# EAGLE design controller (EAGLE 9.5.2)

## Sheet 1 of 4: Controller
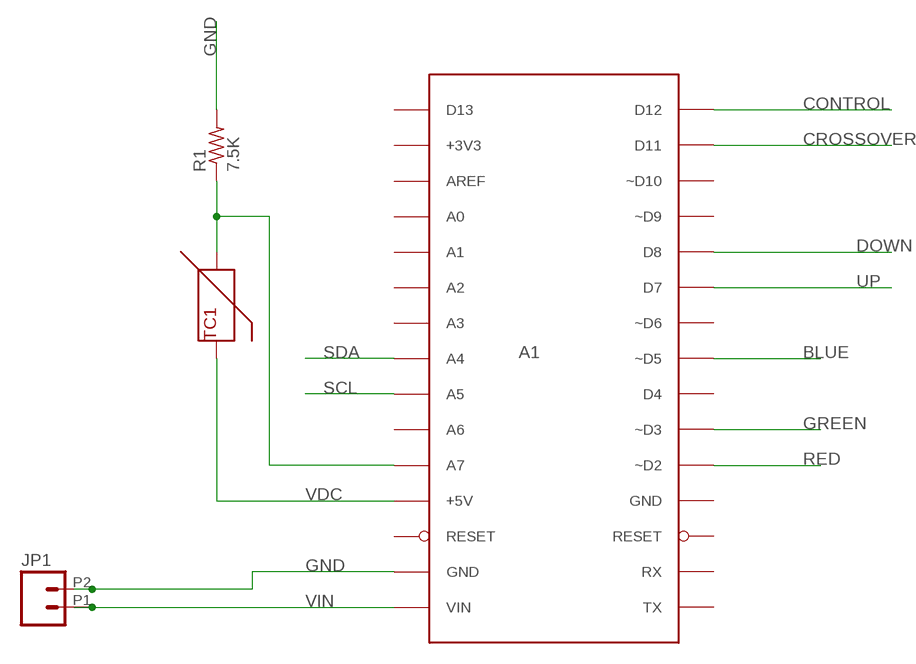
[diagram p0: schematic, sheet 1]

### Parts
A1  NANO_EVERY  [NANO_EVERY_SOCKET]
JP1  1716060000  [WM2-2]
R1  7.5K  YAGEO_CFR  [CFR-25]
TC1  MA100GG103AN  [MA100GG103AN]

### Nets
BLUE: A1.~D5 ; also sheet 3
CONTROL: A1.D12 ; also sheet 2
CROSSOVER: A1.D11 ; also sheet 2
DOWN: A1.D8 ; also sheet 4
GND: A1.GND@1(GND) JP1.P2 R1.P$2 ; also sheet 2,3
GREEN: A1.~D3 ; also sheet 3
N$1: A1.A7 R1.P$1 TC1.P$2
RED: A1.~D2 ; also sheet 3
SCL: A1.A5 ; also sheet 3
SDA: A1.A4 ; also sheet 3
UP: A1.D7 ; also sheet 4
VDC: A1.+5V TC1.P$1 ; also sheet 3,4
VIN: A1.VIN JP1.P1
Unconnected: A1.+3V3 A1.A0 A1.A1 A1.A2 A1.A3 A1.A6 A1.AREF A1.D4 A1.D13 A1.GND@2(GND) A1.RESET@1(RESET) A1.RESET@2(RESET) A1.RX A1.TX A1.~D6 A1.~D9 A1.~D10

## Sheet 2 of 4: Control output
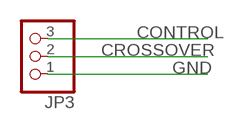
[diagram p1: schematic, sheet 2]

### Parts
JP3  PINHD-1X3/90  [1X03/90]

### Nets
CONTROL: JP3.3 ; also sheet 1
CROSSOVER: JP3.2 ; also sheet 1
GND: JP3.1 ; also sheet 1,3

## Sheet 3 of 4: LCD
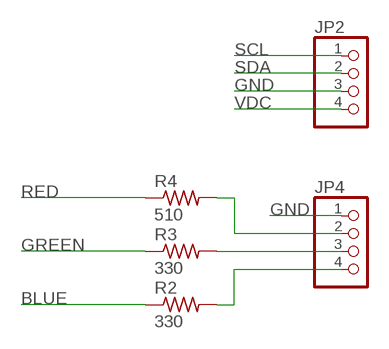
[diagram p2: schematic, sheet 3]

### Parts
JP2  PINHD-1X4  [1X04]
JP4  PINHD-1X4  [1X04]
R2  330  YAGEO-CFR-25  [CFR-25]
R3  330  YAGEO-CFR-25  [CFR-25]
R4  510  YAGEO-CFR-25  [CFR-25]

### Nets
BLUE: R2.P$1 ; also sheet 1
GND: JP2.3 JP4.1 ; also sheet 1,2
GREEN: R3.P$1 ; also sheet 1
N$2: JP4.4 R2.P$2
N$3: JP4.3 R3.P$2
N$4: JP4.2 R4.P$2
RED: R4.P$1 ; also sheet 1
SCL: JP2.1 ; also sheet 1
SDA: JP2.2 ; also sheet 1
VDC: JP2.4 ; also sheet 1,4

## Sheet 4 of 4: User Interface
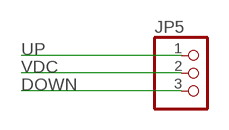
[diagram p3: schematic, sheet 4]

### Parts
JP5  PINHD-1X3  [1X03]

### Nets
DOWN: JP5.3 ; also sheet 1
UP: JP5.1 ; also sheet 1
VDC: JP5.2 ; also sheet 1,3

## Library data of the parts
A1 = Arduino:NANO_EVERY: Nano Every daughter board.
JP1 = ref_lib:1716060000
JP2 JP4 = pinhead:PINHD-1X4: PIN HEADER
JP3 JP5 = pinhead:PINHD-1X3: PIN HEADER
R1 = ref_lib:YAGEO_CFR
R2-R4 = ref_lib:YAGEO-CFR-25
TC1 = thermo:MA100GG103AN: Amphenol thermister

## Board
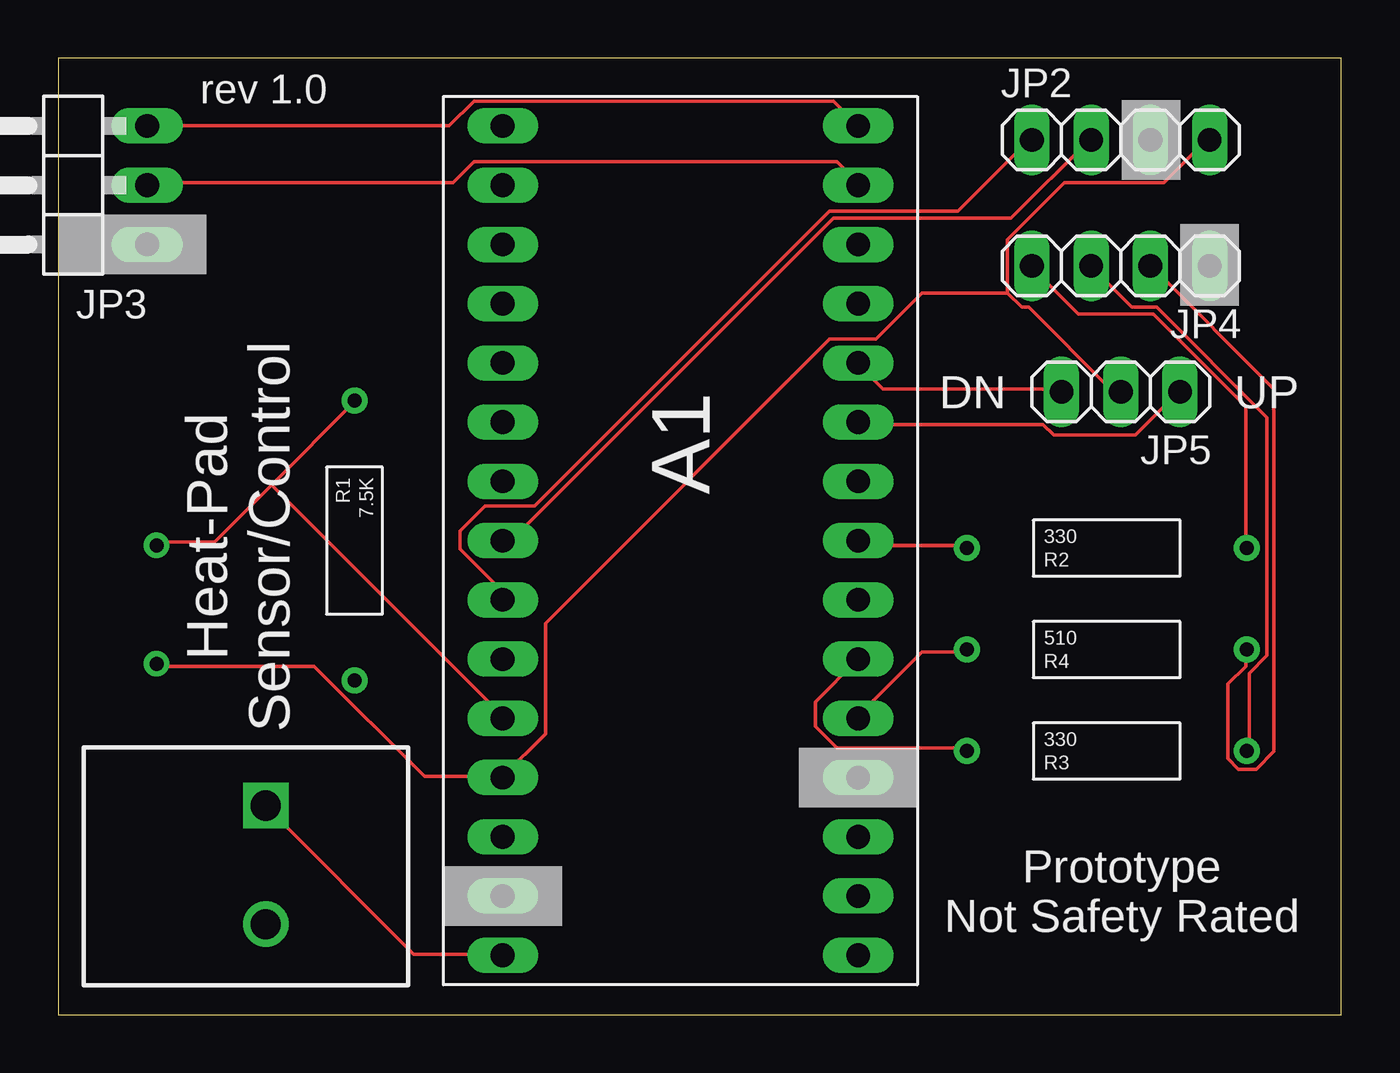
[diagram p4: board, top side]
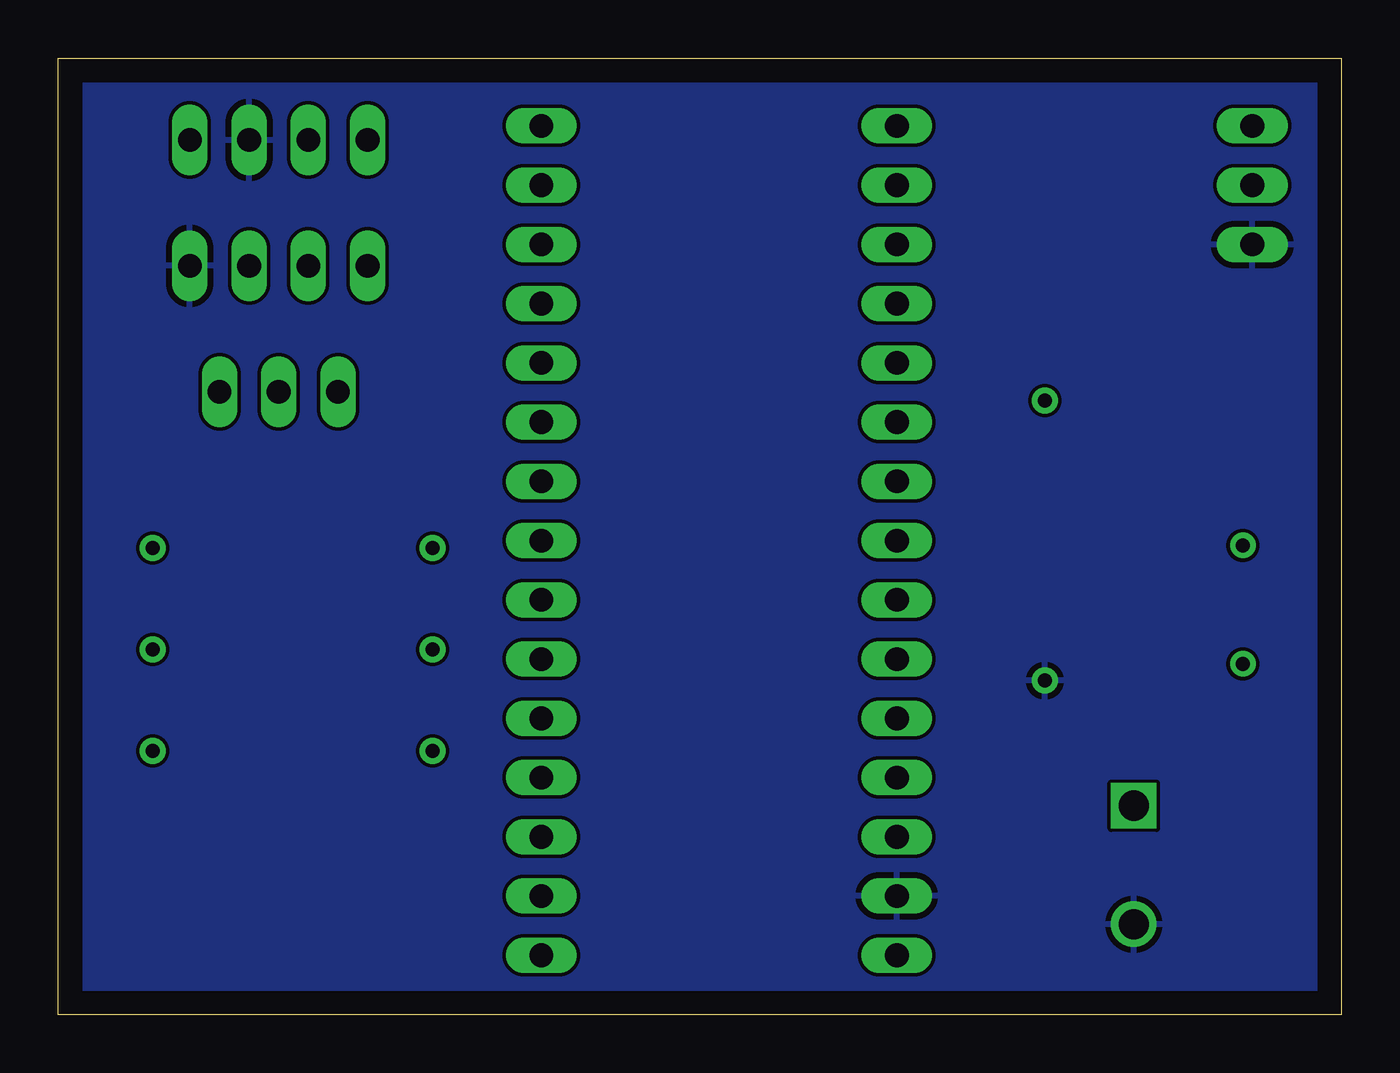
[diagram p5: board, bottom side, seen from below]

Size 55 x 41 mm. Coordinates in mm from the lower left corner, seen from the top.
Outline: 0,0 55,0 55,41 0,41 0,0
Copper layers (1*16): Top 0.035mm / dielectric 1.5mm / Bottom 0.035mm
Design rules "default": minimum track width 6mil, minimum drill 0.35mm, track to track 6mil, track to pad 6mil, pad to pad 6mil, via to via 6mil, smd to smd 6mil, copper to edge 40mil, drill to drill 6mil, minimum pad ring 10mil, minimum via ring 8mil, stop-mask expansion 4mil, vias tented up to drill 0mil, thermal gap 10mil

### Footprints (pad centres in the part's own frame; a part is rotated, then mirrored left to right if it is on the bottom)
NANO_EVERY_SOCKET = drill 1.016 long: +3V3 -15.24,-7.62; +5V 10.16,-7.62; A0 -10.16,-7.62; A1 -7.62,-7.62; A2 -5.08,-7.62; A3 -2.54,-7.62; A4 0,-7.62; A5 2.54,-7.62; A6 5.08,-7.62; A7 7.62,-7.62; AREF -12.7,-7.62; D4 2.54,7.62; D7 -5.08,7.62; D8 -7.62,7.62; D11 -15.24,7.62; D12 -17.78,7.62; D13 -17.78,-7.62; GND@1 15.24,-7.62; GND@2 10.16,7.62; RESET@1 12.7,-7.62; RESET@2 12.7,7.62; RX 15.24,7.62; TX 17.78,7.62; VIN 17.78,-7.62; ~D2 7.62,7.62; ~D3 5.08,7.62; ~D5 0,7.62; ~D6 -2.54,7.62; ~D9 -10.16,7.62; ~D10 -12.7,7.62
WM2-2 = drill 1.3 square: P1 -2.6,0 | drill 1.3: P2 2.48,0
1X04 = drill 1.016 long: 1 -3.81,0; 2 -1.27,0; 3 1.27,0; 4 3.81,0
1X03/90 = drill 1.016 long: 1 -2.54,-3.81; 2 0,-3.81; 3 2.54,-3.81
1X03 = drill 1.016 long: 1 -2.54,0; 2 0,0; 3 2.54,0
CFR-25 = drill 0.6: P$1 -6,0; P$2 6,0
MA100GG103AN = drill 0.6: P$1 -2.54,0; P$2 2.54,0

### Placement (x,y rotation side)
A1  26.67,20.32 270 top
JP1  8.89,6.35 270 top
JP2  45.55,37.5 0 top
JP3  0,35.56 90 top
JP4  45.55,32.1 180 top
JP5  45.55,26.7 180 top
R1  12.7,20.32 270 top
R2  44.95,20 0 top
R3  44.95,11.3 0 top
R4  44.95,15.65 0 top
TC1  4.21,17.58 90 top

### Tracks (layer width: path | path; a pad name or v marks a point on that pad's centre or on a via)
BLUE
  Top 0.152: R2.P$1 38.86,20.12 34.44,20.12 34.29,20.27 A1.~D5
CONTROL
  Top 0.152: JP3.3 16.76,38.1 17.83,39.17 33.22,39.17 A1.D12
CROSSOVER
  Top 0.152: JP3.2 3.81,35.66 16.92,35.66 17.83,36.58 33.38,36.58 34.29,35.66 A1.D11
DOWN
  Top 0.152: JP5.3 42.98,26.82 35.36,26.82 34.29,27.89 A1.D8
GND
  pour Bottom: 1,40 1,1 54,1 54,40
GREEN
  Top 0.152: A1.~D3 32.46,13.41 32.46,12.34 33.38,11.43 38.86,11.43 R3.P$1
N$1
  Top 0.152: 9.14,22.71 12.65,26.21 R1.P$1 | 9.14,22.71 6.71,20.27 4.27,20.27 TC1.P$2 | 9.14,22.71 19.05,12.8 A1.A7
N$2
  Top 0.152: R2.P$2 50.9,20.12 50.9,26.06 46.94,30.02 43.74,30.02 41.76,32 JP4.4
N$3
  Top 0.152: R3.P$2 51.05,11.43 51.05,14.63 51.82,15.39 51.82,25.6 47.09,30.33 46.02,30.33 44.35,32 JP4.3
N$4
  Top 0.152: R4.P$2 50.9,15.54 50.9,14.94 50.14,14.17 50.14,10.97 50.6,10.52 51.36,10.52 52.12,11.28 52.12,26.82 46.94,32 JP4.2
RED
  Top 0.152: R4.P$1 38.86,15.54 37.03,15.54 34.29,12.8 A1.~D2
SCL
  Top 0.152: A1.A5 19.05,18.14 17.22,19.96 17.22,20.73 18.29,21.79 20.42,21.79 33.07,34.44 38.56,34.44 41.6,37.49 JP2.1
SDA
  Top 0.152: A1.A4 19.05,20.42 19.51,20.42 33.22,34.14 40.84,34.14 44.2,37.49 JP2.2
UP
  Top 0.152: A1.D7 34.29,25.3 42.22,25.3 42.67,24.84 46.18,24.84 48.01,26.67 JP5.1
VDC
  Top 0.152: 40.69,30.94 41.3,30.33 41.6,30.33 45.11,26.82 45.41,26.82 JP5.2 | 40.69,30.94 40.69,33.22 43.13,35.66 47.4,35.66 49.23,37.49 JP2.4 | 19.05,10.21 15.7,10.21 10.97,14.94 4.27,14.94 TC1.P$1 | 40.69,30.94 37.03,30.94 35.05,28.96 33.07,28.96 20.88,16.76 20.88,12.04 19.05,10.21 | 19.05,10.21 A1.+5V
VIN
  Top 0.152: A1.VIN 19.05,2.59 15.24,2.59 8.99,8.84 JP1.P1

### Text on the board
tPlace: rev 1.0 | DN | UP | Heat-Pad / Sensor/Control | Prototype / Not Safety Rated